# Altium schematic sheet Sheet1.SchDoc
size B; SheetNumber: 1; SheetTotal: 1
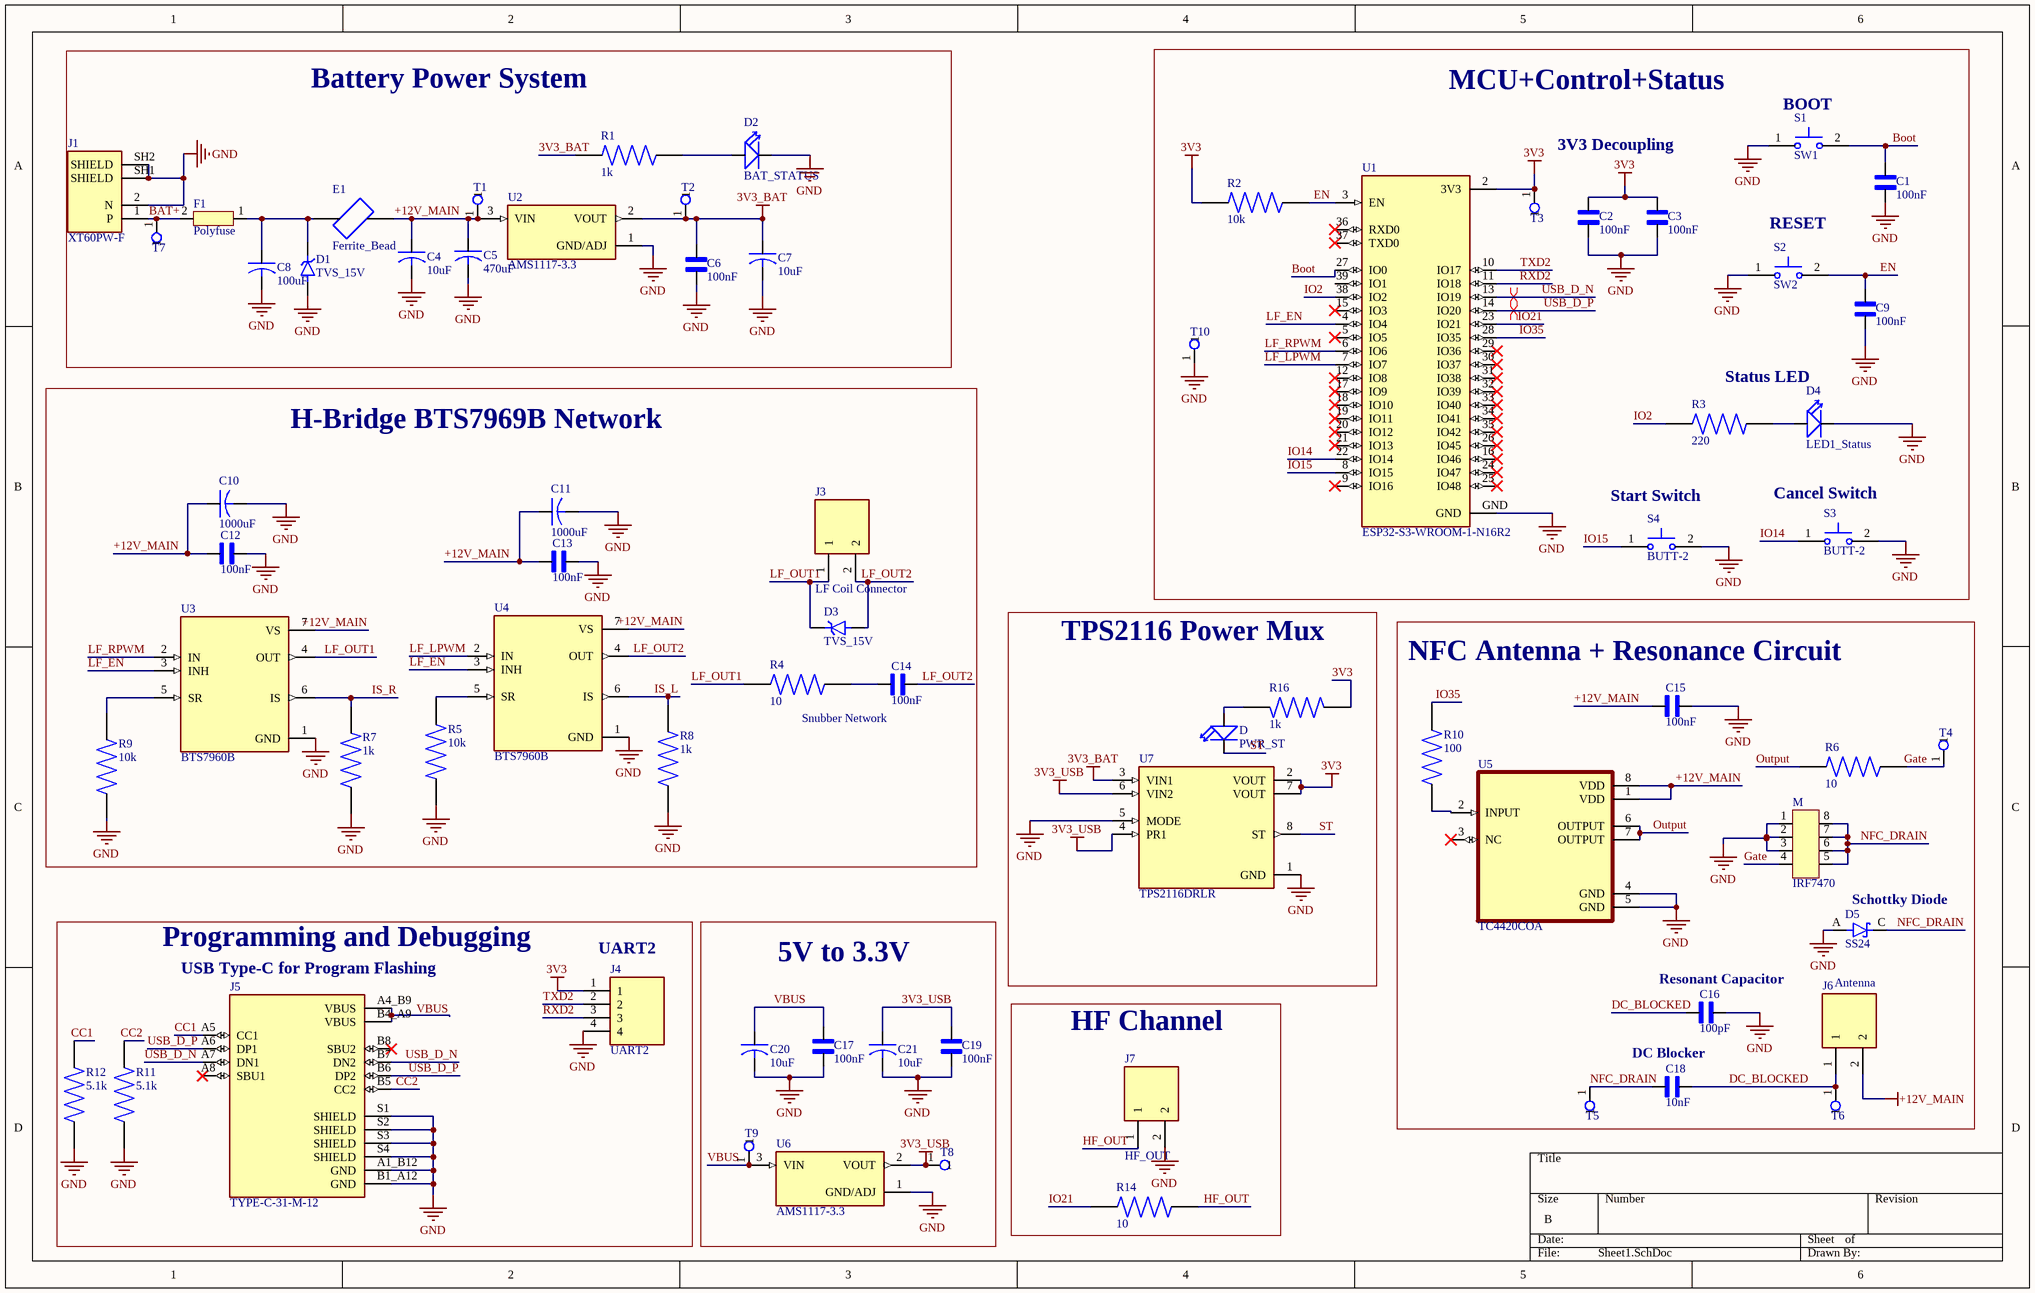
[diagram p0: Sheet1.SchDoc]

## Parts
C1  100nF  [SMD_Ceramic_CAP]
C2  100nF  [SMD_Ceramic_CAP]
C3  100nF  [SMD_Ceramic_CAP]
C4  10uF  [Capacitor_Bipolar-SMD]
C5  470uF  [Capacitor_Bipolar-SMD]
C6  100nF  [SMD_Ceramic_CAP]
C7  10uF  [Capacitor_Bipolar-SMD]
C8  100uF  [Capacitor_Bipolar-SMD]
C9  100nF  [SMD_Ceramic_CAP]
C10  1000uF  [Capacitor_Bipolar-SMD]
C11  1000uF  [Capacitor_Bipolar-SMD]
C12  100nF  [SMD_Ceramic_CAP]
C13  100nF  [SMD_Ceramic_CAP]
C14  100nF  [SMD_Ceramic_CAP]
C15  100nF  [SMD_Ceramic_CAP]
C16  100pF  [SMD_Ceramic_CAP]
C17  100nF  [SMD_Ceramic_CAP]
C18  10nF  [SMD_Ceramic_CAP]
C19  100nF  [SMD_Ceramic_CAP]
C20  10uF  [Capacitor_Bipolar-SMD]
C21  10uF  [Capacitor_Bipolar-SMD]
D  PWR_ST  [LED-0603]
D1  TVS_15V  [TVS_15V]
D2  BAT_STATUS  [LED-0603]
D3  TVS_15V  [TVS_15V]
D4  LED1_Status  [LED-0603]
D5  SS24  [SS24]
E1  Ferrite_Bead  [Ferrite_bead]
F1  Polyfuse  [Polyfuse]
J1  XT60PW-F  [XT60PW-F]
J3  LF Coil Connector  [2_Pin_Terminal_Block]
J4  UART2  [JST_XH_Balance]
J5  TYPE-C-31-M-12  [HRO_TYPE-C-31-M-12]
J6  Antenna  [2_Pin_Terminal_Block]
J7  HF_OUT  [2_Pin_Terminal_Block]
M  IRF7470  [IRF7470]
R1  1k  [Resistor_SMD]
R2  10k  [Resistor_SMD]
R3  220  [Resistor_SMD]
R4  10  [Resistor_SMD]
R5  10k  [Resistor_SMD]
R6  10  [Resistor_SMD]
R7  1k  [Resistor_SMD]
R8  1k  [Resistor_SMD]
R9  10k  [Resistor_SMD]
R10  100  [Resistor_SMD]
R11  5.1k  [Resistor_SMD]
R12  5.1k  [Resistor_SMD]
R14  10  [Resistor_SMD]
R16  1k  [Resistor_SMD]
S1  SW1  [SW_BUTT-2]
S2  SW2  [SW_BUTT-2]
S3  BUTT-2  [SW_BUTT-2]
S4  BUTT-2  [SW_BUTT-2]
T1  Test_Point  [Test_Point]  (value not drawn)  (no BOM)
T2  Test_Point  [Test_Point]  (value not drawn)  (no BOM)
T3  Test_Point  [Test_Point]  (value not drawn)  (no BOM)
T4  Test_Point  [Test_Point]  (value not drawn)  (no BOM)
T5  Test_Point  [Test_Point]  (value not drawn)  (no BOM)
T6  Test_Point  [Test_Point]  (value not drawn)  (no BOM)
T7  Test_Point  [Test_Point]  (value not drawn)  (no BOM)
T8  Test_Point  [Test_Point]  (value not drawn)  (no BOM)
T9  Test_Point  [Test_Point]  (value not drawn)  (no BOM)
T10  Test_Point  [Test_Point]  (value not drawn)  (no BOM)
U1  ESP32-S3-WROOM-1-N16R2  [ESP32-S3-WROOM-1-N16R2]
U2  AMS1117-3.3  [AMS1117-5.0]
U3  BTS7960B  [BTS7960B]
U4  BTS7960B  [BTS7960B]
U5  TC4420COA  [TC4420COA]
U6  AMS1117-3.3  [AMS1117-5.0]
U7  TPS2116DRLR  [TPS2116]

## Blocks framed on the sheet
Battery Power System: C4-C8 D1 D2 E1 F1 J1 R1 T1 T2 T7 U2
MCU+Control+Status: C1-C3 C9 D4 R2 R3 S1-S4 T3 T10 U1
H-Bridge BTS7969B Network: C10-C14 D3 J3 R4 R5 R7-R9 U3 U4
TPS2116 Power Mux: D R16 U7
NFC Antenna + Resonance Circuit: C15 C16 C18 D5 J6 M R6 R10 T4-T6 U5
Programming and Debugging: J4 J5 R11 R12
5V to 3.3V: C17 C19-C21 T8 T9 U6
HF Channel: J7 R14

## Nets
3V3: C2.2 C3.2 J4.1 R2.1 R16.1 T3.1 U1.2(3V3) U7.2(VOUT) U7.7(VOUT)
3V3_BAT: C6.2 C7.1 R1.1 T2.1 U2.2(VOUT) U7.3(VIN1)
3V3_USB: C19.2 C21.1 T8.1 U6.2(VOUT) U7.4(PR1) U7.6(VIN2)
+12V_MAIN: C4.1 C5.1 C10.1 C11.1 C12.1 C13.1 C15.2 E1.2 J6.2 T1.1 U2.3(VIN) U3.7(VS) U4.7(VS) U5.1(VDD) U5.8(VDD)
GND: C1.1 C2.1 C3.1 C4.2 C5.2 C6.1 C7.2 C8.2 C9.1 C10.2 C11.2 C12.2 C13.2 C15.1 C16.2 C17.1 C19.1 C20.2 C21.2 D1.A D2.NEG D4.NEG D5.A J1.2(N) J1.SH1(SHIELD) J1.SH2(SHIELD) J4.4 J5.A1_B12(GND) J5.B1_A12(GND) J5.S1(SHIELD) J5.S2(SHIELD) J5.S3(SHIELD) J5.S4(SHIELD) J7.2 M.1 M.2 M.3 R5.1 R7.1 R8.1 R9.1 R11.1 R12.1 S1.1 S2.1 S3.2 S4.2 T10.1 U1.GND U2.1(GND/ADJ) U3.1(GND) U4.1(GND) U5.4(GND) U5.5(GND) U6.1(GND/ADJ) U7.1(GND) U7.5(MODE)
BAT+: F1.2 J1.1(P) T7.1
Boot: C1.2 S1.2 U1.27(IO0)
CC1: J5.A5(CC1) R12.2
CC2: J5.B5(CC2) R11.2
DC_BLOCKED: C16.1 C18.2 J6.1 T6.1
EN: C9.2 R2.2 S2.2 U1.3(EN)
Gate: M.4 R6.2 T4.1
HF_OUT: J7.1 R14.2
IO2: R3.1 U1.38(IO2)
IO14: S3.1 U1.22(IO14)
IO15: S4.1 U1.8(IO15)
IO21: R14.1 U1.23(IO21)
IO35: R10.1 U1.28(IO35)
IS_L: R8.2 U4.6(IS)
IS_R: R7.2 U3.6(IS)
LF_EN: U1.4(IO4) U3.3(INH) U4.3(INH)
LF_LPWM: U1.7(IO7) U4.2(IN)
LF_OUT1: D3.K J3.1 R4.1 U3.4(OUT)
LF_OUT2: C14.2 D3.A J3.2 U4.4(OUT)
LF_RPWM: U1.6(IO6) U3.2(IN)
NFC_DRAIN: C18.1 D5.C(K) M.5 M.6 M.7 M.8 T5.1
Output: R6.1 U5.6(OUTPUT) U5.7(OUTPUT)
RXD2: J4.3 U1.11(IO18)
ST: D.NEG U7.8(ST)
TXD2: J4.2 U1.10(IO17)
USB_D_N: J5.A7(DN1) J5.B7(DN2) U1.13(IO19)
USB_D_P: J5.A6(DP1) J5.B6(DP2) U1.14(IO20)
VBUS: C17.2 C20.1 J5.A4_B9(VBUS) J5.B4_A9(VBUS) T9.1 U6.3(VIN)
NetC8_1: C8.1 D1.K E1.1 F1.1
NetC14_1: C14.1 R4.2
NetD2_POS: D2.POS R1.2
NetD4_POS: D4.POS R3.2
NetD_POS: D.POS R16.2
NetR5_2: R5.2 U4.5(SR)
NetR9_2: R9.2 U3.5(SR)
NetR10_2: R10.2 U5.2(INPUT)

Not connected (* = marked no-connect by the designer): J5 A8(SBU1)* B8(SBU2)*; U1 5(IO5)* 9(IO16)* 12(IO8)* 15(IO3)* 16(IO46)* 17(IO9)* 18(IO10)* 19(IO11)* 20(IO12)* 21(IO13)* 24(IO47)* 25(IO48)* 26(IO45)* 29(IO36)* 30(IO37)* 31(IO38)* 32(IO39)* 33(IO40)* 34(IO41)* 35(IO42)* 36(RXD0)* 37(TXD0)* 39(IO1); U5 3(NC)*

## Layout directives
differential pair: USB_D_N, USB_D_P

## Notes on the sheet
- 3V3 Decoupling
- (near S1) BOOT
- (near S2) RESET
- Status LED
- Start Switch
- Cancel Switch
- Snubber Network
- (near D5) Schottky Diode
- (near J5) USB Type-C for Program Flashing
- (near J4) UART2
- (near C16) Resonant Capacitor
- DC Blocker

## Library data of the parts
C1-C3 C6 C9 C12-C19 = SMD_Ceramic_CAP: 10000 pF Â±5% 16V Ceramic Capacitor X7R 0805 (2012 Metric); MF: AVX; MP: 0805YC103J4T2A; SnapEDA_Link: https://www.snapeda.com/parts/0805YC103J4T2A/AVX/view-part/?ref=snap; Package: 2012 AVX; Value: *; Check_prices: https://www.snapeda.com/parts/0805YC103J4T2A/AVX/view-part/?ref=eda
C4 C5 C7 C8 C10 C11 C20 C21 = CAPACITOR: <B>CAPACITOR</B>, American symbol; Package: None; Price: None; Value: *; MP: CAPACITOR; Availability: Unavailable
D D2 D4 = SMD-LED(0603): Blue LED Indication - Discrete 2.8V 0603 _1608 Metric_; MF: Everlight; MP: 19-217/BHC-ZL1M2RY/3T; Value: *; SnapEDA_Link: https://www.snapeda.com/parts/19-217/BHC-ZL1M2RY/3T/Everlight%20Electronics%20Co%20Ltd/view-part/105869/?ref=snap; Price: None; Availability: Unavailable; Package: 0603 Everlight
D1 D3 = TVS_15V: 15V Clamp 80A Ipp Tvs Diode Surface Mount SGP1610N2; MF: Semtech Corporation; MP: UCLAMP0571P.TNT; SnapEDA_Link: https://www.snapeda.com/parts/UCLAMP0571P.TNT/Semtech+Corporation/view-part/?ref=snap; Package: UDFN-2 Semtech; Value: *; Check_prices: https://www.snapeda.com/parts/UCLAMP0571P.TNT/Semtech+Corporation/view-part/?ref=eda
D5 = SS24: Diode Schottky 40V 2A Surface Mount DO-214AA (SMB); MF: ON Semiconductor; Package: DO-214AA ON Semiconductor; Price: None; Value: *; SnapEDA_Link: https://www.snapeda.com/parts/SS24/Onsemi/view-part/?ref=snap; MP: SS24; Availability: In Stock; Check_prices: https://www.snapeda.com/parts/SS24/Onsemi/view-part/?ref=eda
E1 = Ferrite_Bead: 120 Ohms @ 100 MHz 1 Power, Signal Line Ferrite Bead 0603 (1608 Metric) 700mA 200mOhm; MF: Laird; MP: LI0603G121R-10; Purchase-URL: https://pricing.snapeda.com/search/part/LI0603G121R-10/?ref=eda; SnapEDA_Link: https://www.snapeda.com/parts/LI0603G121R-10/Laird/view-part/?ref=snap; Package: 0603 Laird; Price: None; Value: *; Availability: In Stock; Check_prices: https://www.snapeda.com/parts/LI0603G121R-10/Laird/view-part/?ref=eda
J1 = XT60PW-F: Connector: DC supply; socket; female; XT60; 30A; 500V; PIN: 2; THT; MF: AMASS; SnapEDA_Link: https://www.snapeda.com/parts/XT60PW-F/AMASS/view-part/?ref=snap; Package: Package; Value: *; MP: XT60PW-F; Check_prices: https://www.snapeda.com/parts/XT60PW-F/AMASS/view-part/?ref=eda
J3 J6 J7 = 2_Pin_Terminal_Block: 2 Pin Terminal Block 5mm Pitch; MF: Handson Technology; MP: KF301-2P; SnapEDA_Link: https://www.snapeda.com/parts/KF301-2P/Handson+Technology/view-part/?ref=snap; Package: None; Value: *; Check_prices: https://www.snapeda.com/parts/KF301-2P/Handson+Technology/view-part/?ref=eda
J4 = 4_pin_header: MTA-100 HEADER - TIN, 04P MTA100 HDR ASSY SQ R/A POL | TE Connectivity 640455-4; SnapEDA_Link: https://www.snapeda.com/parts/640455-4/TE+Connectivity+AMP+Connectors/view-part/?ref=snap; Package: None; Value: *; MF: TE Connectivity; MP: 640455-4; Check_prices: https://www.snapeda.com/parts/640455-4/TE+Connectivity+AMP+Connectors/view-part/?ref=eda
J5 = TYPE-C-31-M-12: USB Connectors 24 Receptacle 1 8.94*7.3mm RoHS; MF: HRO Electronics Co., Ltd.; SnapEDA_Link: https://www.snapeda.com/parts/TYPE-C-31-M-12/HRO+Electronics+Co.%252C+Ltd./view-part/?ref=snap; Package: Package; Value: *; MP: TYPE-C-31-M-12; Check_prices: https://www.snapeda.com/parts/TYPE-C-31-M-12/HRO+Electronics+Co.%252C+Ltd./view-part/?ref=eda
R1 = Resisto_SMD: 1 kOhms Â±0.5% 0.063W, 1/16W Chip Resistor 0603 (1608 Metric) - Thin Film; MF: Susumu; MP: RR0816P-102-D; SnapEDA_Link: https://www.snapeda.com/parts/RR0816P-102-D/Susumu/view-part/?ref=snap; Package: 1608 Susumu; Value: *; Check_prices: https://www.snapeda.com/parts/RR0816P-102-D/Susumu/view-part/?ref=eda
R2-R12 R14 R16 = Resistor_SMD: 1 kOhms Â±0.5% 0.063W, 1/16W Chip Resistor 0603 (1608 Metric) - Thin Film; MF: Susumu; MP: RR0816P-102-D; SnapEDA_Link: https://www.snapeda.com/parts/RR0816P-102-D/Susumu/view-part/?ref=snap; Package: 1608 Susumu; Value: *; Check_prices: https://www.snapeda.com/parts/RR0816P-102-D/Susumu/view-part/?ref=eda
S1-S4 = BUTT-2: Tactile Switches MINI PUSH BUTTON SWITCH 2-PIN QTY. 4; MF: Gravitech; SnapEDA_Link: https://www.snapeda.com/parts/BUTT-2/Gravitech/view-part/?ref=snap; Package: None; Value: *; MP: BUTT-2; Check_prices: https://www.snapeda.com/parts/BUTT-2/Gravitech/view-part/?ref=eda
U1 = ESP32-S3-WROOM-1-N16R2: Bluetooth, WiFi 802.11b/g/n, Bluetooth v5.0 Transceiver Module 2.4GHz PCB Trace Surface Mount; MF: Espressif Systems; MP: ESP32S3WROOM1N16R2; SnapEDA_Link: https://www.snapeda.com/parts/ESP32S3WROOM1N16R2/Espressif+Systems/view-part/?ref=snap; Package: NON STANDARD Espressif Systems; Value: *; Check_prices: https://www.snapeda.com/parts/ESP32S3WROOM1N16R2/Espressif+Systems/view-part/?ref=eda
U2 U6 = AMS1117-5.0: 1A LOW DROPOUT VOLTAGE REGULATOR; MF: ams; MP: AMS1117-5.0; Package: SOT-223 Seeed Technology; SnapEDA_Link: https://www.snapeda.com/parts/AMS1117-5.0/ams/view-part/?ref=snap; Check_prices: https://www.snapeda.com/parts/AMS1117-5.0/ams/view-part/?ref=eda; Availability: Not in stock; Value: *; Price: None
U3 U4 = BTS7960B: Half Bridge Driver DC Motors, General Purpose DMOS PG-TO263-7-1; MF: Infineon; SnapEDA_Link: https://www.snapeda.com/parts/BTS7960B/Infineon/view-part/?ref=snap; Package: TO-263 Infineon; Value: *; MP: BTS7960B; Check_prices: https://www.snapeda.com/parts/BTS7960B/Infineon/view-part/?ref=eda
U5 = TC4420COA: Microchip TC4420COA,MOSFET Power Driver 6A,4.5 to 18V,Non-Inverting,8-Pin SOIC | Microchip Technology Inc. TC4420COA; SnapEDA_Link: https://www.snapeda.com/parts/TC4420COA/Microchip/view-part/?ref=snap; Package: SOIC-8 Microchip; Value: *; MF: Microchip Technology; MP: TC4420COA; Check_prices: https://www.snapeda.com/parts/TC4420COA/Microchip/view-part/?ref=eda
U7 = TPS2116DRLR: 1.6-V to 5.5-V, 40-mâ„¦, 2.5-A, low-IQ, priority power multiplexer; MF: Texas Instruments; SnapEDA_Link: https://www.snapeda.com/parts/TPS2116DRLR/Texas+Instruments/view-part/?ref=snap; Package: None; Value: *; MP: TPS2116DRLR; Check_prices: https://www.snapeda.com/parts/TPS2116DRLR/Texas+Instruments/view-part/?ref=eda